# EAGLE design Triple_Axis_Accelerometer_-_Gyro_Breakout_-_MPU-6050 (EAGLE 8.2.2)
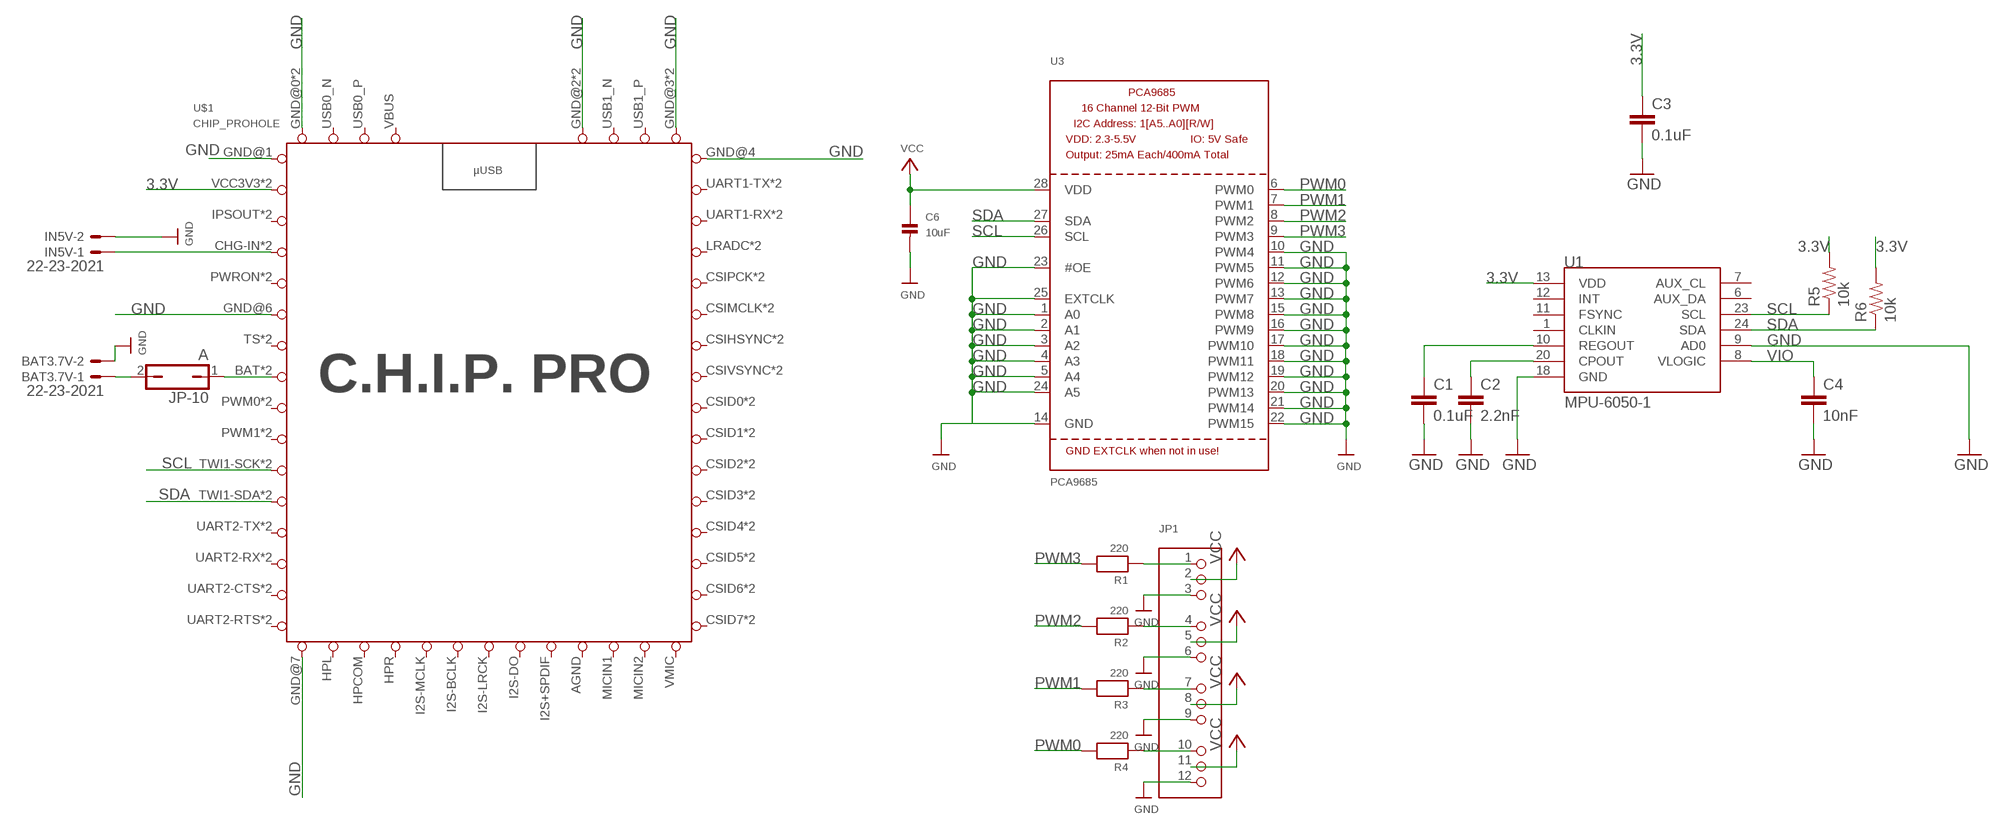
[diagram p0: schematic, sheet 1]

## Parts
BAT3.7V  22-23-2021  [22-23-2021]
C1  0.1uF  CAP0603-CAP  [0603-CAP]
C2  2.2nF  CAP0603-CAP  [0603-CAP]
C3  0.1uF  CAP0603-CAP  [0603-CAP]
C4  10nF  CAP0603-CAP  [0603-CAP]
C6  10uF  CAP_CERAMIC0805  [0805]
IN5V  22-23-2021  [22-23-2021]
JP1  HEADER-3X04  [3X04]
JP-10  A  JP1Q  [JP1]
R1  220  RESISTOR0805  [0805]
R2  220  RESISTOR0805  [0805]
R3  220  RESISTOR0805  [0805]
R4  220  RESISTOR0805  [0805]
R5  10k  R-US_R0805  [R0805]
R6  10k  R-US_R0805  [R0805]
U1  MPU-6050-1  [QFN-24-4MM2]
U3  PCA9685  [TSSOP28]
U$1  CHIP_PROHOLE  [CHIP_PRO_HOLE]

## Nets
3.3V: C3.1 R5.2 R6.2 U1.13(VDD) U$1.VCC3V3 U$1.VCC3V3-1(VCC3V3)
GND: BAT3.7V.2 C1.2 C2.2 C3.2 C4.2 C6.2 IN5V.2 JP1.3 JP1.6 JP1.9 JP1.12 U1.9(AD0) U1.18(GND) U3.1(A0) U3.2(A1) U3.3(A2) U3.4(A3) U3.5(A4) U3.10(PWM4) U3.11(PWM5) U3.12(PWM6) U3.13(PWM7) U3.14(GND) U3.15(PWM8) U3.16(PWM9) U3.17(PWM10) U3.18(PWM11) U3.19(PWM12) U3.20(PWM13) U3.21(PWM14) U3.22(PWM15) U3.23(#OE) U3.24(A5) U3.25(EXTCLK) U$1.GND@0(GND) U$1.GND@0-1(GND) U$1.GND@1(GND) U$1.GND@2(GND) U$1.GND@2-1(GND) U$1.GND@3(GND) U$1.GND@3-1(GND) U$1.GND@4(GND) U$1.GND@6(GND) U$1.GND@7(GND)
N$1: JP1.1 R1.1
N$2: JP1.4 R2.1
N$3: C2.1 U1.20(CPOUT)
N$4: JP1.7 R3.1
N$5: C1.1 U1.10(REGOUT)
N$6: JP1.10 R4.1
N$9: IN5V.1 U$1.CHG-IN U$1.CHG-IN-1(CHG-IN)
PWM0: R4.2 U3.6(PWM0)
PWM1: R3.2 U3.7(PWM1)
PWM2: R2.2 U3.8(PWM2)
PWM3: R1.2 U3.9(PWM3)
SCL: R5.1 U1.23(SCL) U3.26(SCL) U$1.TWI1-SCK U$1.TWI1-SCK-1(TWI1-SCK)
SDA: R6.1 U1.24(SDA) U3.27(SDA) U$1.TWI1-SDA U$1.TWI1-SDA-1(TWI1-SDA)
VCC: BAT3.7V.1 C6.1 JP1.2 JP1.5 JP1.8 JP1.11 JP-10.1 JP-10.2 U3.28(VDD) U$1.BAT U$1.BAT-1(BAT)
VIO: C4.1 U1.8(VLOGIC)
Unconnected: U1.1(CLKIN) U1.6(AUX_DA) U1.7(AUX_CL) U1.11(FSYNC) U1.12(INT) U$1.CSID0 U$1.CSID0-1(CSID0) U$1.CSID1 U$1.CSID1-1(CSID1) U$1.CSID2 U$1.CSID2-1(CSID2) U$1.CSID3 U$1.CSID3-1(CSID3) U$1.CSID4 U$1.CSID4-1(CSID4) U$1.CSID5 U$1.CSID5-1(CSID5) U$1.CSID6 U$1.CSID6-1(CSID6) U$1.CSID7 U$1.CSID7-1(CSID7) U$1.CSIHSYNC U$1.CSIHSYNC-1(CSIHSYNC) U$1.CSIMCLK U$1.CSIMCLK-1(CSIMCLK) U$1.CSIPCK U$1.CSIPCK-1(CSIPCK) U$1.CSIVSYNC U$1.CSIVSYNC-1(CSIVSYNC) U$1.HPCOM U$1.HPL U$1.HPR U$1.I2S+SPDIF(I2SSPDIF) U$1.I2S-BCLK(I2SBCLK) U$1.I2S-DO(I2SDO) U$1.I2S-LRCK(I2SLRCK) U$1.I2S-MCLK(I2SMCLK) U$1.LRADC U$1.LRADC-1(LRADC) U$1.MICIN1 U$1.MICIN2 U$1.PWM0 U$1.PWM0-1(PWM0) U$1.PWM1 U$1.PWM1-1(PWM1) U$1.PWRON U$1.PWRON-1(PWRON) U$1.TS U$1.TS-1(TS) U$1.UART1-RX U$1.UART1-RX-1(UART1-RX) U$1.UART1-TX U$1.UART1-TX-1(UART1-TX) U$1.UART2-CTS U$1.UART2-CTS-1(UART2-CTS) U$1.UART2-RTS U$1.UART2-RTS-1(UART2-RTS) U$1.UART2-RX U$1.UART2-RX-1(UART2-RX) U$1.UART2-TX U$1.UART2-TX-1(UART2-TX) U$1.USB0_N U$1.USB0_P U$1.USB1_N U$1.USB1_P U$1.VMIC

## Power pins joined to a net without a drawn wire
AGND: U$1.AGND
IPSOUT: U$1.IPSOUT U$1.IPSOUT-1(IPSOUT)
VBUS: U$1.VBUS

## Library data of the parts
BAT3.7V IN5V = con-molex:22-23-2021: .100" (2.54mm) Center Header - 2 Pin; MF: MOLEX; MPN: 22-23-2021; OC_FARNELL: 1462926; OC_NEWARK: 25C3832
C1-C4 = SparkFun:CAP: Capacitor Standard 0603 ceramic capacitor, and 0.1" leaded capacitor.
C6 = microbuilder:CAP_CERAMIC: Ceramic Capacitors 0402 - 0402 Surface Mount Capacitors 16pF 50V 5% [Digikey: 445-4899-2-ND] 18pF 50V 5% [Digikey: 490-1281-2-ND] 22pF 50V 5% [Digikey: 490-1283-2-ND] 68pF 50V 5% [Digikey: 490-1289-2-ND] 0.1uF 10V 10% [Digikey: 490-1318-2-ND] 1.0uF 6.3V 10% [Digikey: 490-1320-2-ND] 0603 - 0603 Surface Mount Capacitors 16 pF 50V 5% [Digikey: 445-5051-2-ND] 22 pF 50V [Digikey: PCC220ACVTR-ND] 33 pF 50V 5% [Digikey: 490-1415-1-ND] 56pF 50V 5% [Digikey: 490-1421-1-ND] 220pF 50V 5% [Digikey: 445-1285-1-ND] 680 pF 50V 2200 pF 50V 5% C0G [Digikey: 445-1297-1-ND] 5600 pF 100V 5% X7R [Digikey: 478-3711-1-ND] 0.1 µF 25V 10% [Digikey: PCC2277TR-ND] 0.22 µF 16V 10% X7R [Digikey: 445-1318-1-ND] 1.0 µF 25V 10% [Digikey: 445-5146-2-ND] 0603 - RF Specific 3pF 250V +/-0.1pF RF [Digikey: 712-1347-1-ND] 18 pF 250V 5% [Digikey: 478-3505-1-ND or 712-1322-1-ND] 56 pF 250V 5% C0G RF [Digikey: 490-4867-1-ND] 68 pF 250V RF [Digikey: 490-4868-1-ND] 0805 - 0805 Surface Mount Capacitors 220 pF 250V 2% RF Ceramic Capacitor [Digikey: 712-1398-1-ND] 1000 pF 50V 2% NP0 Ceramic Capacitor [Digikey: 478-3760-1-ND] 0.1 µF 25V 10% Ceramic Capacitor [Digikey: PCC1828TR-ND] 1.0 µF 16V 10% Ceramic Capacitor[Digikey: 490-1691-2-ND] 10.0 µF 10V 10% Ceramic Capacitor[Digikey: 709-1228-1-ND] 10.0 uF 16V 10% Ceramic Capacitor [Digikey: 478-5165-2-ND] 47 uF 6.3V 20% Ceramic Capacitor [Digikey: 587-1779-1-ND or 399-5506-1-ND] 1206 - 1206 Surface Mount Capacitors 47uF 10V 20% Ceramic Capacitor [Digikey: 490-5528-1-ND or 399-5508-1-ND or 445-6010-1-ND] 100uF 6.3V -20%, +80% Y5V Ceramic Capacitor (Digikey: 490-4512-1-ND, Mouser: 81-GRM31CF50J107ZE1L)
JP1 = microbuilder:HEADER-3X04
JP-10 = jumper:JP1Q: JUMPER
R1-R4 = microbuilder:RESISTOR: Resistors 0402 - 0402 Surface Mount Package 22 Ohm 1% 1/16W [Digikey: 311-22.0LRTR-ND] 33 Ohm 5% 1/16W 1.0K 5% 1/16W 1.5K 5% 1/16W 2.0K 1% 1/16W 10.0K 1% 1/16W [Digikey: 311-10.0KLRTR-ND] 10.0K 5% 1/16W [Digikey: RMCF0402JT10K0TR-ND] 12.1K 1% 1/16W [Digikey: 311-22.0LRTR-ND] 100.0K 5% 1/16W 0603 - 0603 Surface Mount Package 0 Ohm 1/10 Watt 1% Resistor 15 Ohm 1/10 Watt 1% Resistor 33 Ohm 1/10 Watt 1% Resistor 49.9 Ohm 1/10 Watt 1% Resistor 100 Ohm 1/10 Watt 1% Resistor 150 Ohm 1/10 Watt 1% Resistor 240 Ohm 1/10 Watt 1% Resistor 390 Ohm 1/10 Watt 1% Resistor 560 Ohm 1/10 Watt 1% Resistor 680 Ohm 1/10 Watt 1% Resistor 750 Ohm 1/10 Watt 1% Resistor 1.0K Ohm 1/10 Watt 1% Resistor 1.5K Ohm 1/10 Watt 1% Resistor 2.0K Ohm 1/10 Watt 1% Resistor 2.2K Ohm 1/10 Watt 1% Resistor 3.3K Ohm 1/10 Watt 1% Resistor 4.7K Ohm 1/10 Watt 1% Resistor 10.0K Ohm 1/10 Watt 1% Resistor 12.0K Ohm 1/10 Watt 1% Resistor 12.1K Ohm 1/10 Watt 1% Resistor 20.0K Ohm 1/10 Watt 1% Resistor 33.0K Ohm 1/10 Watt 1% Resistor 100.0K Ohm 1/10 Watt 1% Resistor 0805 - 0805 Surface Mount Package 0 Ohm 1/8 Watt 1% Resistor 33 Ohm 1/8 Watt 1% Resistor 100 Ohm 1/8 Watt 1% Resistor 150 Ohm 1/8 Watt 1% Resistor 200 Ohm 1/8 Watt 1% Resistor 240 Ohm 1/8 Watt 1% Resistor 330 Ohm 1/8 Watt 1% Resistor 390 Ohm 1/8 Watt 1% Resistor 470 Ohm 1/8 Watt 1% Resistor 1.0K Ohm 1/8 Watt 1% Resistor 1.5K Ohm 1/8 Watt 1% Resistor 2.0K Ohm 1/8 Watt 1% Resistor 4.7K Ohm 1/8 Watt 1% Resistor 5.1K Ohm 1/8 Watt 1% Resistor 5.6K Ohm 1/8 Watt 1% Resistor 10.0K Ohm 1/8 Watt 1% Resistor 22.0K Ohm 1/8 Watt 1% Resistor 33.0K Ohm 1/8 Watt 1% Resistor 100K Ohm 1/8 Watt 1% Resistor 1206 - 1206 Surface Mount Package 2012 - 2010 Surface Mount Package 0.11 Ohm 1/2 Watt 1% Resistor - Digikey: RHM.11UCT-ND
R5 R6 = rcl:R-US_: RESISTOR, American symbol
U1 = Testing:MPU-6050
U3 = microbuilder:PCA9685: PCA9685 - 16 Channel 12-Bit I2C PWM Controller 5.0V tolerant 16 channel, 12-bit I2C PWM controller with 25mA per output (max. 400mA total) Digikey: 568-5931-1-ND
U$1 = CHIP_Pro-Footprint:CHIP_PRO

## Net classes
0 Default: width 0.203 mm
1 vcc: width 0.254 mm
2 GND: width 0.813 mm

## Board
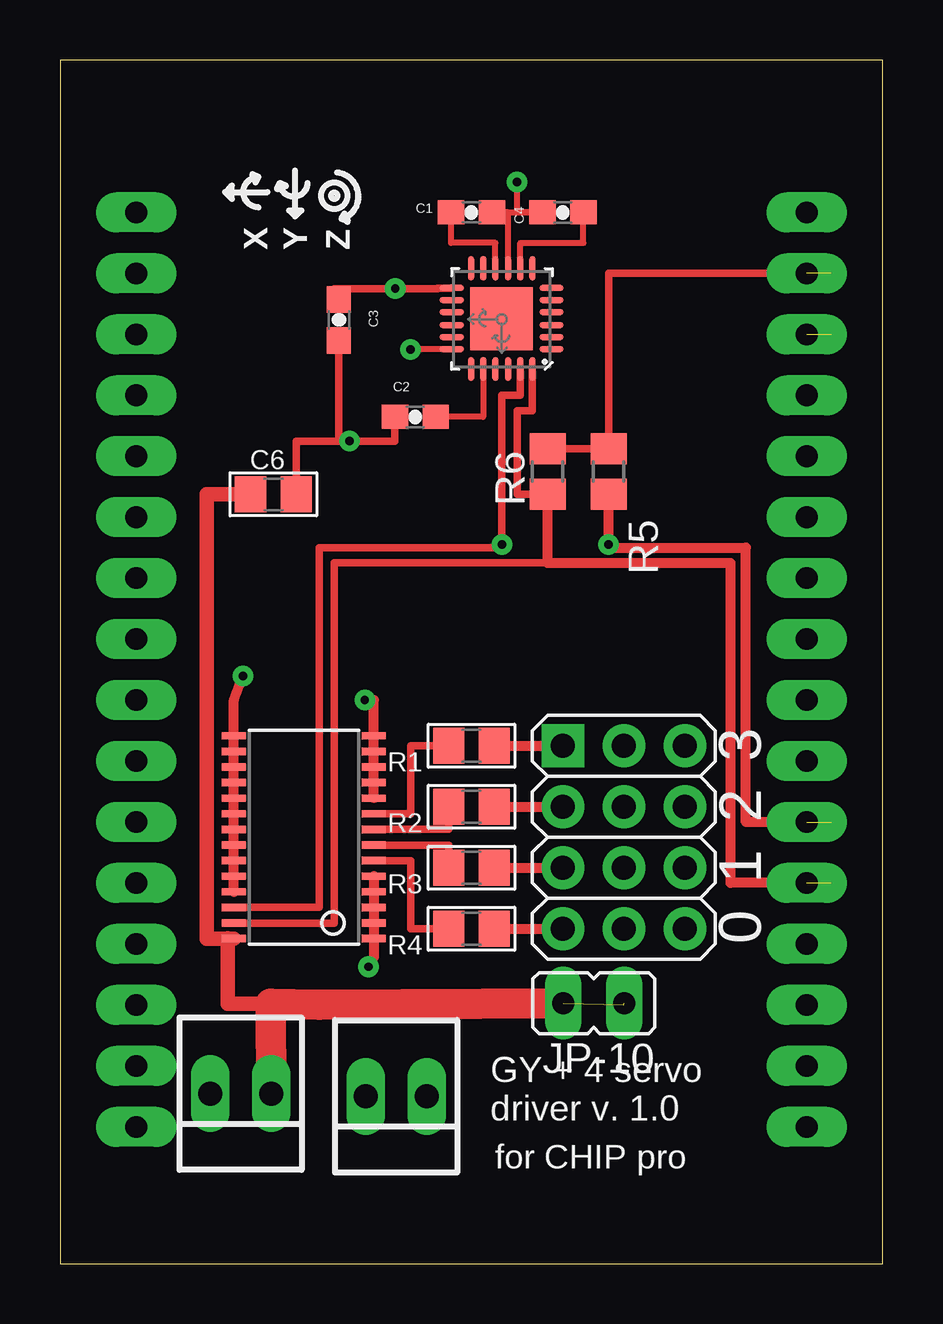
[diagram p1: board, top side]
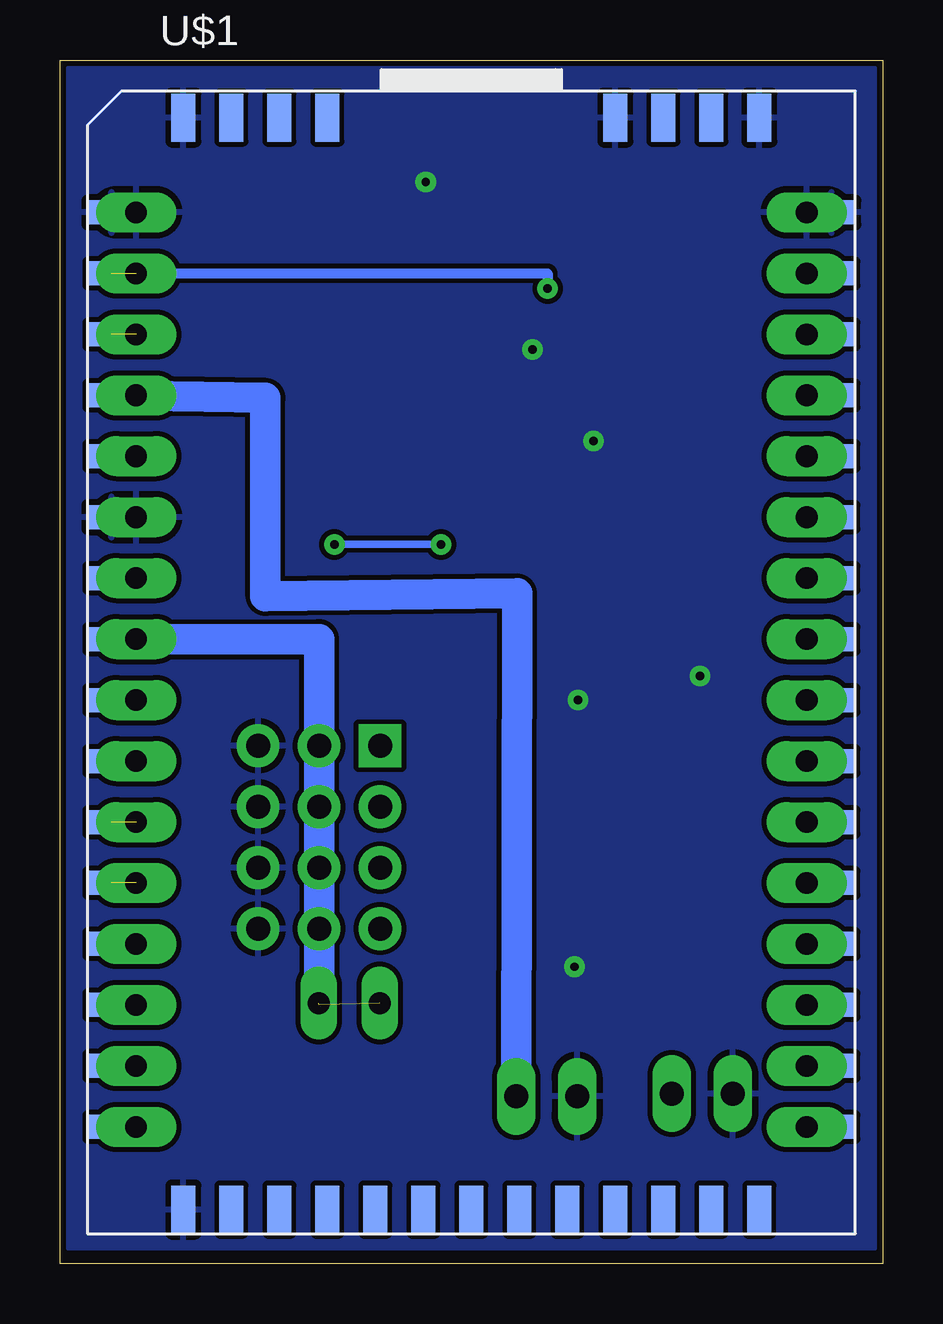
[diagram p2: board, bottom side, seen from below]

Size 34.29 x 50.17 mm. Coordinates in mm from the lower left corner, seen from the top.
Copper layers (1*16): Top 0.035mm / dielectric 1.5mm / Bottom 0.035mm
Design rules "SparkFun *": minimum track width 7mil, minimum drill 15mil, track to track 8mil, track to pad 8mil, pad to pad 8mil, via to via 8mil, smd to smd 8mil, copper to edge 8mil, drill to drill 8mil, minimum pad ring 12mil, minimum via ring 10mil, stop-mask expansion 4mil, vias tented up to drill 20mil, thermal gap 10mil
Milling: area 0,0 to 34.3,50.2

### Footprints (pad centres in the part's own frame; a part is rotated, then mirrored left to right if it is on the bottom)
22-23-2021 = drill 1 long: 1 -1.27,0; 2 1.27,0
0603-CAP = smd 1.1 x 1: 1 -0.85,0; 2 0.85,0
0805 = smd 1.3 x 1.5: 1 -0.95,0; 2 0.95,0
3X04 = drill 1 pad 1.778 square: 1 -3.81,-2.54 | drill 1 pad 1.778: 2 -3.81,0; 3 -3.81,2.54; 4 -1.27,-2.54; 5 -1.27,0; 6 -1.27,2.54; 7 1.27,-2.54; 8 1.27,0; 9 1.27,2.54; 10 3.81,-2.54; 11 3.81,0; 12 3.81,2.54
JP1 = drill 0.914 long: 1 0,-1.27; 2 0,1.27
R0805 = smd 1.3 x 1.5: 1 -0.95,0; 2 0.95,0
QFN-24-4MM2 = smd 1.016 x 0.254: 1 -2.066,1.257; 2 -2.066,0.75; 3 -2.066,0.247; 4 -2.066,-0.287; 5 -2.066,-0.792; 6 -2.066,-1.297; 13 2.086,-1.297; 14 2.086,-0.792; 15 2.086,-0.287; 16 2.086,0.247; 17 2.086,0.75; 18 2.086,1.257 | smd 0.254 x 1.016: 7 -1.267,-2.122; 8 -0.762,-2.122; 9 -0.258,-2.122; 10 0.278,-2.122; 11 0.78,-2.122; 12 1.287,-2.122; 19 1.287,2.082; 20 0.78,2.082; 21 0.278,2.082; 22 -0.258,2.082; 23 -0.762,2.082; 24 -1.267,2.082 | smd 2.616 x 2.616: P$1 0.02,-0.01
TSSOP28 = smd 0.305 x 0.991: 1 -4.225,-2.918; 2 -3.575,-2.918; 3 -2.925,-2.918; 4 -2.275,-2.918; 5 -1.625,-2.918; 6 -0.975,-2.918; 7 -0.325,-2.918; 8 0.325,-2.918; 9 0.975,-2.918; 10 1.625,-2.918; 11 2.275,-2.918; 12 2.925,-2.918; 13 3.575,-2.918; 14 4.225,-2.918; 15 4.225,2.918; 16 3.575,2.918; 17 2.925,2.918; 18 2.275,2.918; 19 1.625,2.918; 20 0.975,2.918; 21 0.325,2.918; 22 -0.325,2.918; 23 -0.975,2.918; 24 -1.625,2.918; 25 -2.275,2.918; 26 -2.925,2.918; 27 -3.575,2.918; 28 -4.225,2.918
CHIP_PRO_HOLE = smd 1 x 2: AGND 6,-22.5; GND@1 -12,-22.5; GND@4 -12,23; GND@6 6,23; GND@7 12,23; HPCOM -8,-22.5; HPL -10,-22.5; HPR -6,-22.5; I2S+SPDIF 4,-22.5; I2S-BCLK -2,-22.5; I2S-DO 2,-22.5; I2S-LRCK 0,-22.5; I2S-MCLK -4,-22.5; MICIN1 8,-22.5; MICIN2 10,-22.5; USB0_N -10,23; USB0_P -8,23; USB1_N 8,23; USB1_P 10,23; VBUS -6,23; VMIC 12,-22.5 | smd 2 x 1: BAT -15,1.27; CHG-IN -15,11.43; CSID0 15,-1.27; CSID1 15,-3.81; CSID2 15,-6.35; CSID3 15,-8.89; CSID4 15,-11.43; CSID5 15,-13.97; CSID6 15,-16.51; CSID7 15,-19.05; CSIHSYNC 15,3.81; CSIMCLK 15,6.35; CSIPCK 15,8.89; CSIVSYNC 15,1.27; GND@0 15,19.05; GND@2 -15,6.35; GND@3 -15,19.05; IPSOUT -15,13.97; LRADC 15,11.43; PWM0 -15,-1.27; PWM1 -15,-3.81; PWRON -15,8.89; TS -15,3.81; TWI1-SCK -15,-6.35; TWI1-SDA -15,-8.89; UART1-RX 15,13.97; UART1-TX 15,16.51; UART2-CTS -15,-16.51; UART2-RTS -15,-19.05; UART2-RX -15,-13.97; UART2-TX -15,-11.43; VCC3V3 -15,16.51 | drill 0.9 pad 1.676 long: BAT-1 -13.97,1.27; CHG-IN-1 -13.97,11.43; CSID0-1 13.97,-1.27; CSID1-1 13.97,-3.81; CSID2-1 13.97,-6.35; CSID3-1 13.97,-8.89; CSID4-1 13.97,-11.43; CSID5-1 13.97,-13.97; CSID6-1 13.97,-16.51; CSID7-1 13.97,-19.05; CSIHSYNC-1 13.97,3.81; CSIMCLK-1 13.97,6.35; CSIPCK-1 13.97,8.89; CSIVSYNC-1 13.97,1.27; GND@0-1 13.97,19.05; GND@2-1 -13.97,6.35; GND@3-1 -13.97,19.05; IPSOUT-1 -13.97,13.97; LRADC-1 13.97,11.43; PWM0-1 -13.97,-1.27; PWM1-1 -13.97,-3.81; PWRON-1 -13.97,8.89; TS-1 -13.97,3.81; TWI1-SCK-1 -13.97,-6.35; TWI1-SDA-1 -13.97,-8.89; UART1-RX-1 13.97,13.97; UART1-TX-1 13.97,16.51; UART2-CTS-1 -13.97,-16.51; UART2-RTS-1 -13.97,-19.05; UART2-RX-1 -13.97,-13.97; UART2-TX-1 -13.97,-11.43; VCC3V3-1 -13.97,16.51

### Placement (x,y rotation side)
BAT3.7V  7.52,7.1 180 top
C1  17.14,43.82 0 top
C2  14.81,35.29 180 top
C3  11.62,39.33 270 top
C4  20.95,43.82 180 top
C6  8.89,32.07 0 top
IN5V  14.01,6.99 180 top
JP1  23.49,17.78 270 top
JP-10  22.25,10.87 90 top
R1  17.14,21.59 180 top
R2  17.14,19.05 180 top
R3  17.14,16.51 180 top
R4  17.14,13.97 180 top
R5  22.86,33.02 90 top
R6  20.32,33.02 90 top
U1  18.41,39.37 180 top
U3  10.16,17.78 90 top
U$1  17.14,24.77 0 bottom

### Tracks (layer width: path | path; a pad name or v marks a point on that pad's centre or on a via)
3.3V  (via drill 0.35)  (1 unrouted)
  Top 0.305: U1.13 16.31,40.65 15.75,40.65 15.74,40.64 v13.97,40.64 11.43,40.64 11.43,40.18 C3.1 | R6.2 R5.2 22.86,41.28 U$1.VCC3V3-1
  Bottom 0.406: v13.97,40.64 13.97,41.28 U$1.VCC3V3
GND  (via drill 0.35)
  Top 0.254: U1.18 14.6,38.11 | U1.9 18.67,43.82 C1.2 C4.2 19.05,43.82 v19.05,45.09
  Top 0.305: C3.2 11.62,34.29 v12.06,34.29 | C6.2 9.84,34.29 v12.06,34.29 | C2.2 13.96,34.29 v12.06,34.29 | 14.6,38.11 v14.6,38.1
  Top 0.406: U3.25 U3.24 U3.23 U3.22 U3.21 U3.20 U3.19 U3.18 U3.17 U3.16 U3.15 7.24,23.5 v7.62,24.5 | U3.10 U3.11 U3.12 U3.13 U3.14 13.08,23.5 v12.7,23.5 | U3.5 U3.4 U3.3 U3.2 U3.1 13.08,12.8 v12.86,12.38
  pour Bottom: 33.97,49.85 33.97,0.64 0.32,0.64 0.32,49.85
IPSOUT  (1 unrouted)
N$1
  Top 0.406: R1.1 JP1.1
N$2
  Top 0.406: R2.1 JP1.4
N$3
  Top 0.254: U1.20 17.63,35.29 C2.1
N$4
  Top 0.406: R3.1 JP1.7
N$5
  Top 0.254: U1.10 18.14,42.55 16.29,42.55 C1.1
N$6
  Top 0.406: R4.1 JP1.10
N$9
  Bottom 1.27: IN5V.1 15.24,27.94 25.73,27.83 25.73,36.09 U$1.CHG-IN
PWM0
  Top 0.305: U3.6 14.6,16.81 14.6,13.97 R4.2
PWM1
  Top 0.305: U3.7 16.19,17.46 R3.2
PWM2
  Top 0.305: U3.8 16.19,18.11 R2.2
PWM3
  Top 0.305: U3.9 14.6,18.76 14.6,21.59 R1.2
SCL  (via drill 0.35)  (1 unrouted)
  Top 0.305: U3.26 10.79,14.86 10.79,29.85 18.41,29.85 v18.41,29.98 18.41,36.2 19.18,36.2 U1.23
  Top 0.406: U$1.TWI1-SCK-1 28.57,18.42 28.57,29.85 22.86,29.85 v22.86,29.98 R5.1
  Bottom 0.305: v18.41,29.98 v22.86,29.98
SDA  (1 unrouted)
  Top 0.305: U3.27 11.43,14.21 11.43,29.21 20.32,29.21 | R6.1 19.05,32.07 19.05,35.56 19.68,35.56 U1.24
  Top 0.406: R6.1 20.32,29.21 27.94,29.21 27.94,15.88 U$1.TWI1-SDA-1
VCC  (2 unrouted)
  Top 0.406: U3.28 6.98,13.56 6.98,12.97
  Top 0.61: 6.98,13.57 6.98,12.97 6.98,10.84 8.78,10.85 | U3.28 6.11,13.56 6.11,32.07 C6.1
  Top 1.27: BAT3.7V.1 8.78,10.85 10.79,10.81 JP-10.2
  Bottom 1.27: U$1.BAT 23.49,26.04 JP1.2 JP1.5 JP1.8 JP1.11 23.49,10.8
VIO
  Top 0.254: U1.8 19.18,42.55 21.8,42.55 C4.1

### Text on the board
tPlace: X | Y | Z | 3 | 2 | 1 | 0 | GY + 4 servo / driver v. 1.0 | for CHIP pro